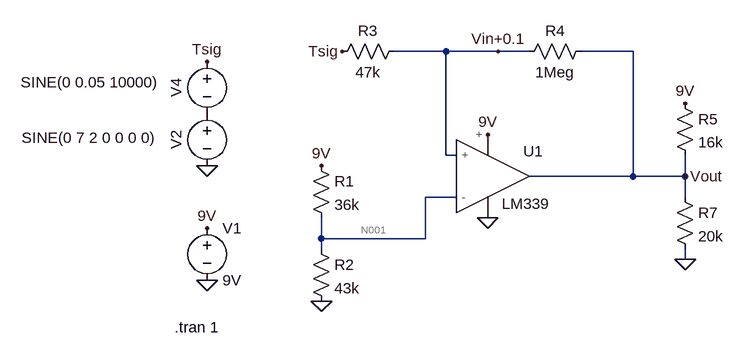
[diagram p0: schematic hysteresis_test_circuit.asc]
hysteresis_test_circuit.asc, the LTspice schematic file:
Version 4
SHEET 1 960 680
WIRE 112 -48 32 -48
WIRE 192 -48 112 -48
WIRE 240 -48 192 -48
WIRE 400 -48 320 -48
WIRE 112 112 112 -48
WIRE 128 112 112 112
WIRE 400 144 400 -48
WIRE 400 144 240 144
WIRE 480 144 480 112
WIRE 480 144 400 144
WIRE 128 176 80 176
WIRE 480 176 480 144
WIRE -80 240 -80 208
WIRE 80 240 80 176
WIRE 80 240 -80 240
WIRE -80 256 -80 240
WIRE 480 272 480 256
FLAG -256 304 0
FLAG -80 336 0
FLAG 176 208 0
FLAG -256 224 9V
FLAG 176 80 9V
FLAG -256 128 0
FLAG -256 -32 Tsig
FLAG 480 144 Vout
FLAG 192 -48 Vin+0.1
FLAG 480 32 9V
FLAG 480 272 0
FLAG -48 -48 Tsig
FLAG -80 128 9V
SYMBOL AutoGenerated\\LM339 160 144 R0
SYMATTR InstName U1
SYMBOL voltage -256 208 R0
WINDOW 123 0 0 Left 0
WINDOW 39 0 0 Left 0
SYMATTR InstName V1
SYMATTR Value 9V
SYMBOL res -96 112 R0
SYMATTR InstName R1
SYMATTR Value 36k
SYMBOL res -96 240 R0
SYMATTR InstName R2
SYMATTR Value 43k
SYMBOL res 48 -64 R90
WINDOW 0 0 56 VBottom 2
WINDOW 3 32 56 VTop 2
SYMATTR InstName R3
SYMATTR Value 47k
SYMBOL res 336 -64 R90
WINDOW 0 0 56 VBottom 2
WINDOW 3 32 56 VTop 2
SYMATTR InstName R4
SYMATTR Value 1Meg
SYMBOL voltage -256 32 R0
WINDOW 0 -32 56 VBottom 2
WINDOW 3 -182 68 Bottom 2
WINDOW 123 0 0 Left 0
WINDOW 39 0 0 Left 0
SYMATTR InstName V2
SYMATTR Value SINE(0 7 2 0 0 0 0)
SYMBOL res 464 16 R0
SYMATTR InstName R5
SYMATTR Value 16k
SYMBOL res 464 160 R0
SYMATTR InstName R7
SYMATTR Value 20k
SYMBOL voltage -256 -48 R0
WINDOW 0 -32 56 VBottom 2
WINDOW 3 -180 32 Top 2
WINDOW 123 0 0 Left 0
WINDOW 39 0 0 Left 0
SYMATTR InstName V4
SYMATTR Value SINE(0 0.05 10000)
TEXT -306 376 Left 2 !.tran 1

The netlist it stands for:
* hysteresis_test_circuit.asc
XU1 Vin+0.1 N001 9V 0 Vout LM339  ; pins + - + - ?
V1 9V 0 9V
R1 9V N001 36k
R2 N001 0 43k
R3 Vin+0.1 Tsig 47k
R4 Vout Vin+0.1 1Meg
V2 P001 0 SINE(0 7 2 0 0 0 0)
R5 9V Vout 16k
R7 Vout 0 20k
V4 Tsig P001 SINE(0 0.05 10000)
.tran 1
.lib C:\Users\walto\Desktop\School\2021-Spring\COMPE-496A\senior_design\mini_project\LM339.5_1
.backanno
.end

* Results of the author's LTspice run, read from the files saved beside the schematic
* Operating Point, zero values left out:
*   V(9v) = 9 V
*   V(vin+0.1) = 4.594 mV
*   V(n001) = 4.899 V
*   V(vout) = 52.36 mV
*   I(R7) = 2.618 µA
*   I(R5) = 559.2 µA
*   I(R4) = 47.76 nA
*   I(R3) = 97.74 nA
*   I(R2) = 113.9 µA
*   I(R1) = 113.9 µA
*   I(V4) = 97.74 nA
*   I(V2) = 97.74 nA
*   I(V1) = -867.6 µA
*   Ix(u1:1) = -49.98 nA
*   Ix(u1:2) = 9.655 pA
*   Ix(u1:3) = 194.4 µA
*   Ix(u1:4) = -750.9 µA
*   Ix(u1:5) = 556.6 µA